# EAGLE design McPiFace-Camera-V1 (EAGLE 7.4.0)
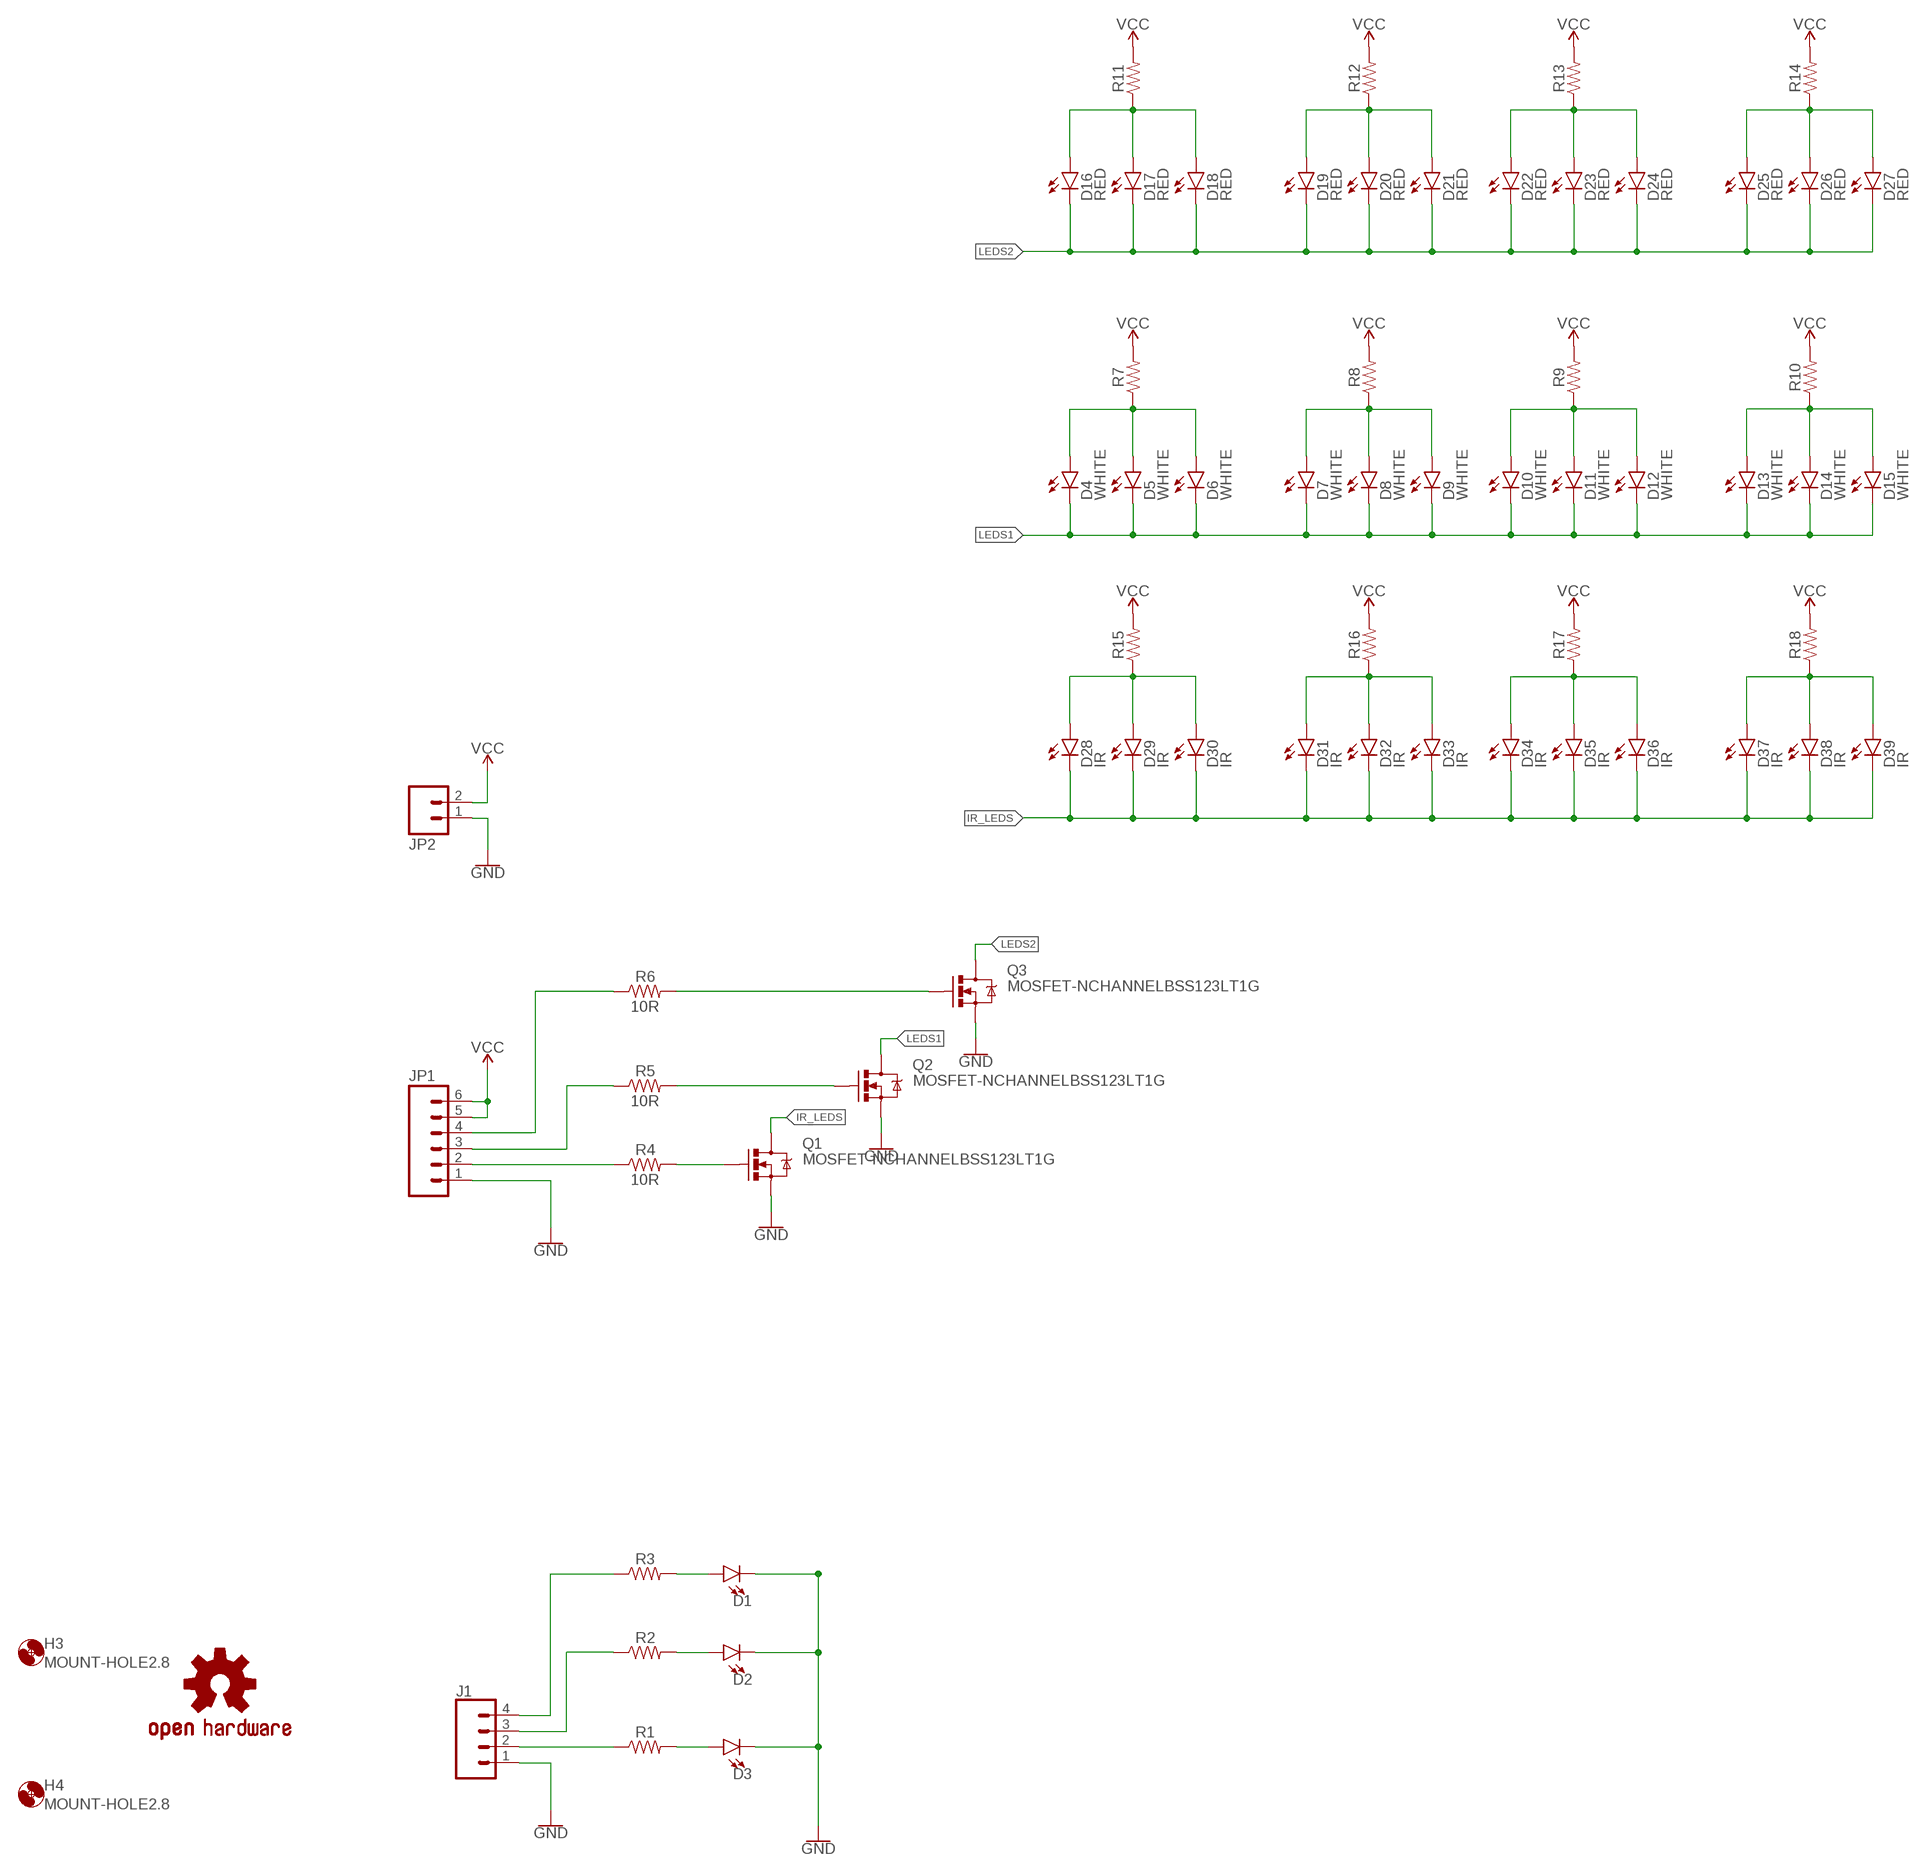
[diagram p0: schematic, sheet 1]

## Parts
D1  LED1206-BOTTOM-1.6MM  [LED-1206-BOTTOM-1.6MM]
D2  LED1206-BOTTOM-1.6MM  [LED-1206-BOTTOM-1.6MM]
D3  LED1206-BOTTOM-1.6MM  [LED-1206-BOTTOM-1.6MM]
D4  WHITE  LED-WHITE1206  [LED-1206]
D5  WHITE  LED-WHITE1206  [LED-1206]
D6  WHITE  LED-WHITE1206  [LED-1206]
D7  WHITE  LED-WHITE1206  [LED-1206]
D8  WHITE  LED-WHITE1206  [LED-1206]
D9  WHITE  LED-WHITE1206  [LED-1206]
D10  WHITE  LED-WHITE1206  [LED-1206]
D11  WHITE  LED-WHITE1206  [LED-1206]
D12  WHITE  LED-WHITE1206  [LED-1206]
D13  WHITE  LED-WHITE1206  [LED-1206]
D14  WHITE  LED-WHITE1206  [LED-1206]
D15  WHITE  LED-WHITE1206  [LED-1206]
D16  RED  LED-RED1206  [LED-1206]
D17  RED  LED-RED1206  [LED-1206]
D18  RED  LED-RED1206  [LED-1206]
D19  RED  LED-RED1206  [LED-1206]
D20  RED  LED-RED1206  [LED-1206]
D21  RED  LED-RED1206  [LED-1206]
D22  RED  LED-RED1206  [LED-1206]
D23  RED  LED-RED1206  [LED-1206]
D24  RED  LED-RED1206  [LED-1206]
D25  RED  LED-RED1206  [LED-1206]
D26  RED  LED-RED1206  [LED-1206]
D27  RED  LED-RED1206  [LED-1206]
D28  IR  LED1206  [LED-1206]
D29  IR  LED1206  [LED-1206]
D30  IR  LED1206  [LED-1206]
D31  IR  LED1206  [LED-1206]
D32  IR  LED1206  [LED-1206]
D33  IR  LED1206  [LED-1206]
D34  IR  LED1206  [LED-1206]
D35  IR  LED1206  [LED-1206]
D36  IR  LED1206  [LED-1206]
D37  IR  LED1206  [LED-1206]
D38  IR  LED1206  [LED-1206]
D39  IR  LED1206  [LED-1206]
H3  MOUNT-HOLE2.8  [2,8]
H4  MOUNT-HOLE2.8  [2,8]
J1  CONN_04SMD2  [1X04_1MM_RA]
JP1  M06SMD-1MM  [1X06-1MM]
JP2  M02-JST-2MM-SMT  [JST-2-SMD]
LOGO1  OSHW-LOGOL  [OSHW-LOGO-L]
Q1  MOSFET-NCHANNELBSS123LT1G  [SOT23-3]
Q2  MOSFET-NCHANNELBSS123LT1G  [SOT23-3]
Q3  MOSFET-NCHANNELBSS123LT1G  [SOT23-3]
R1  RESISTOR1206  [1206]
R2  RESISTOR1206  [1206]
R3  RESISTOR1206  [1206]
R4  10R  RESISTOR1206  [1206]
R5  10R  RESISTOR1206  [1206]
R6  10R  RESISTOR1206  [1206]
R7  RESISTOR1206  [1206]
R8  RESISTOR1206  [1206]
R9  RESISTOR1206  [1206]
R10  RESISTOR1206  [1206]
R11  RESISTOR1206  [1206]
R12  RESISTOR1206  [1206]
R13  RESISTOR1206  [1206]
R14  RESISTOR1206  [1206]
R15  RESISTOR1206  [1206]
R16  RESISTOR1206  [1206]
R17  RESISTOR1206  [1206]
R18  RESISTOR1206  [1206]

## Nets
GND: D1.C D2.C D3.C J1.1 JP1.1 JP2.1 Q1.2(S) Q2.2(S) Q3.2(S)
IR_LEDS: D28.C D29.C D30.C D31.C D32.C D33.C D34.C D35.C D36.C D37.C D38.C D39.C Q1.3(D)
LEDS1: D4.C D5.C D6.C D7.C D8.C D9.C D10.C D11.C D12.C D13.C D14.C D15.C Q2.3(D)
LEDS2: D16.C D17.C D18.C D19.C D20.C D21.C D22.C D23.C D24.C D25.C D26.C D27.C Q3.3(D)
N$2: D1.A R3.2
N$3: D2.A R2.2
N$4: D3.A R1.2
N$5: J1.2 R1.1
N$6: J1.3 R2.1
N$7: J1.4 R3.1
N$8: JP1.2 R4.1
N$9: JP1.3 R5.1
N$10: JP1.4 R6.1
N$11: Q3.1(G) R6.2
N$12: Q2.1(G) R5.2
N$13: Q1.1(G) R4.2
N$17: D13.A D14.A D15.A R10.1
N$18: D10.A D11.A D12.A R9.1
N$23: D7.A D8.A D9.A R8.1
N$25: D4.A D5.A D6.A R7.1
N$29: D16.A D17.A D18.A R11.1
N$32: D19.A D20.A D21.A R12.1
N$35: D22.A D23.A D24.A R13.1
N$38: D25.A D26.A D27.A R14.1
N$41: D28.A D29.A D30.A R15.1
N$44: D31.A D32.A D33.A R16.1
N$45: D34.A D35.A D36.A R17.1
N$46: D37.A D38.A D39.A R18.1
VCC: JP1.5 JP1.6 JP2.2 R7.2 R8.2 R9.2 R10.2 R11.2 R12.2 R13.2 R14.2 R15.2 R16.2 R17.2 R18.2

## Library data of the parts
D1-D3 = ThingySticks:LED: LED (Generic) Standard schematic elements and footprints for 5mm, 3mm, 1206, and 0603 sized LEDs. Generic LEDs with no color specified.
D4-D15 = SparkFun-LED:LED-WHITE: White SMD LEDs LilyPad 1206- DIO-09955; PROD_ID: DIO-09955
D16-D27 = SparkFun-LED:LED-RED: Assorted Red LEDs LilyPad 1206- DIO-09912 1206- DIO-00809 0603- DIO-00819 "SMART" means more efficient and expensive; PROD_ID: DIO-09912
D28-D39 = SparkFun-LED:LED: LEDs Standard schematic elements and footprints for 5mm, 3mm, 1206, and 0603 sized LEDs. 5mm - Spark Fun Electronics SKU : COM-00529 (and others)
H3 H4 = holes:MOUNT-HOLE: MOUNTING HOLE with drill center marker
J1 = SparkFun-Connectors:CONN_04: Multi connection point. Often used as Generic Header-pin footprint for 0.1 inch spaced/style header connections On any of the 0.1 inch spaced packages, you can populate with these: Break Away Headers - Straight <https://www.sparkfun.com/products/116> (PRT-00116) Break Away Male Headers - Right Angle <https://www.sparkfun.com/products/553> (PRT-00553) Female Headers <https://www.sparkfun.com/products/115> (PRT-00115) Break Away Headers - Machine Pin <https://www.sparkfun.com/products/117> (PRT-00117) Break Away Female Headers - Swiss Machine Pin <https://www.sparkfun.com/products/743> (PRT-00743) For SCREWTERMINALS and SPRING TERMINALS visit here: Screw Terimnals on SparkFun.com <https://www.sparkfun.com/search/results?term=Screw+Terminals> (5mm/3.5mm/2.54mm spacing) This device is also useful as a general connection point to wire up your design to another part of your project. Our various solder wires solder well into these plated through hole pads. Hook-Up Wire - Assortment (Stranded, 22 AWG) <https://www.sparkfun.com/products/11375> (PRT-11375) Hook-Up Wire - Assortment (Solid Core, 22 AWG) <https://www.sparkfun.com/products/11367> (PRT-11367) View the entire wire category on our website here <https://www.sparkfun.com/categories/141> Special notes: Molex polarized connector foot print use with SKU : PRT-08231 with associated crimp pins and housings. 1MM SMD Version SKU: PRT-10208; PROD_ID: CONN-10310; SF_ID: PRT-10208
JP1 = SparkFun-Connectors:M06: Header 6 Standard 6-pin 0.1" header. Use with straight break away headers (SKU : PRT-00116), right angle break away headers (PRT-00553), swiss pins (PRT-00743), machine pins (PRT-00117), and female headers (PRT-00115). Molex polarized connector foot print use with SKU : PRT-08094 with associated crimp pins and housings. NOTES ON THE VARIANTS LOCK and LOCK_LONGPADS... This footprint was designed to help hold the alignment of a through-hole component (i.e. 6-pin header) while soldering it into place. You may notice that each hole has been shifted either up or down by 0.005 of an inch from it's more standard position (which is a perfectly straight line). This slight alteration caused the pins (the squares in the middle) to touch the edges of the holes. Because they are alternating, it causes a "brace" to hold the component in place. 0.005 has proven to be the perfect amount of "off-center" position when using our standard breakaway headers. Although looks a little odd when you look at the bare footprint, once you have a header in there, the alteration is very hard to notice. Also,if you push a header all the way into place, it is covered up entirely on the bottom side. This idea of altering the position of holes to aid alignment will be further integrated into the Sparkfun Library for other footprints. It can help hold any component with 3 or more connection pins.
JP2 = SparkFun-Connectors:M02: Standard 2-pin 0.1" header. Use with - straight break away headers ( PRT-00116) - right angle break away headers (PRT-00553) - swiss pins (PRT-00743) - machine pins (PRT-00117) - female headers (PRT-00115) Molex polarized connector foot print use with: PRT-08233 with associated crimp pins and housings. 2.54_SCREWTERM for use with PRT-10571. 3.5mm Screw Terminal footprints for PRT-08084 5mm Screw Terminal footprints for use with PRT-08432; PROD_ID: CONN-11443
LOGO1 = SparkFun-Aesthetics:OSHW-LOGO: Open-Source Hardware (OSHW) Logo This logo indicates the piece of hardware it is found on incorporates a OSHW license and/or adheres to the definition of open source hardware found here: http://freedomdefined.org/OSHW
Q1-Q3 = SparkFun-DiscreteSemi:MOSFET-NCHANNEL: Common NMOSFET Parts MFG P/N Store ID Prod ID FDD8780 TRANS-09984 SI7820DN TRANS-11055 FDS6630A IC-08089 2N7002PW TRANS-11151 FQP30N06L COM-10213 TRANS-10060 BSS123LT1G TRANS-08345 BSS138 TRANS-00830 BS170 2N7000; PROD_ID: TRANS-08345
R1-R18 = SparkFun-Resistors:RESISTOR: Generic Resistor Package

## Board
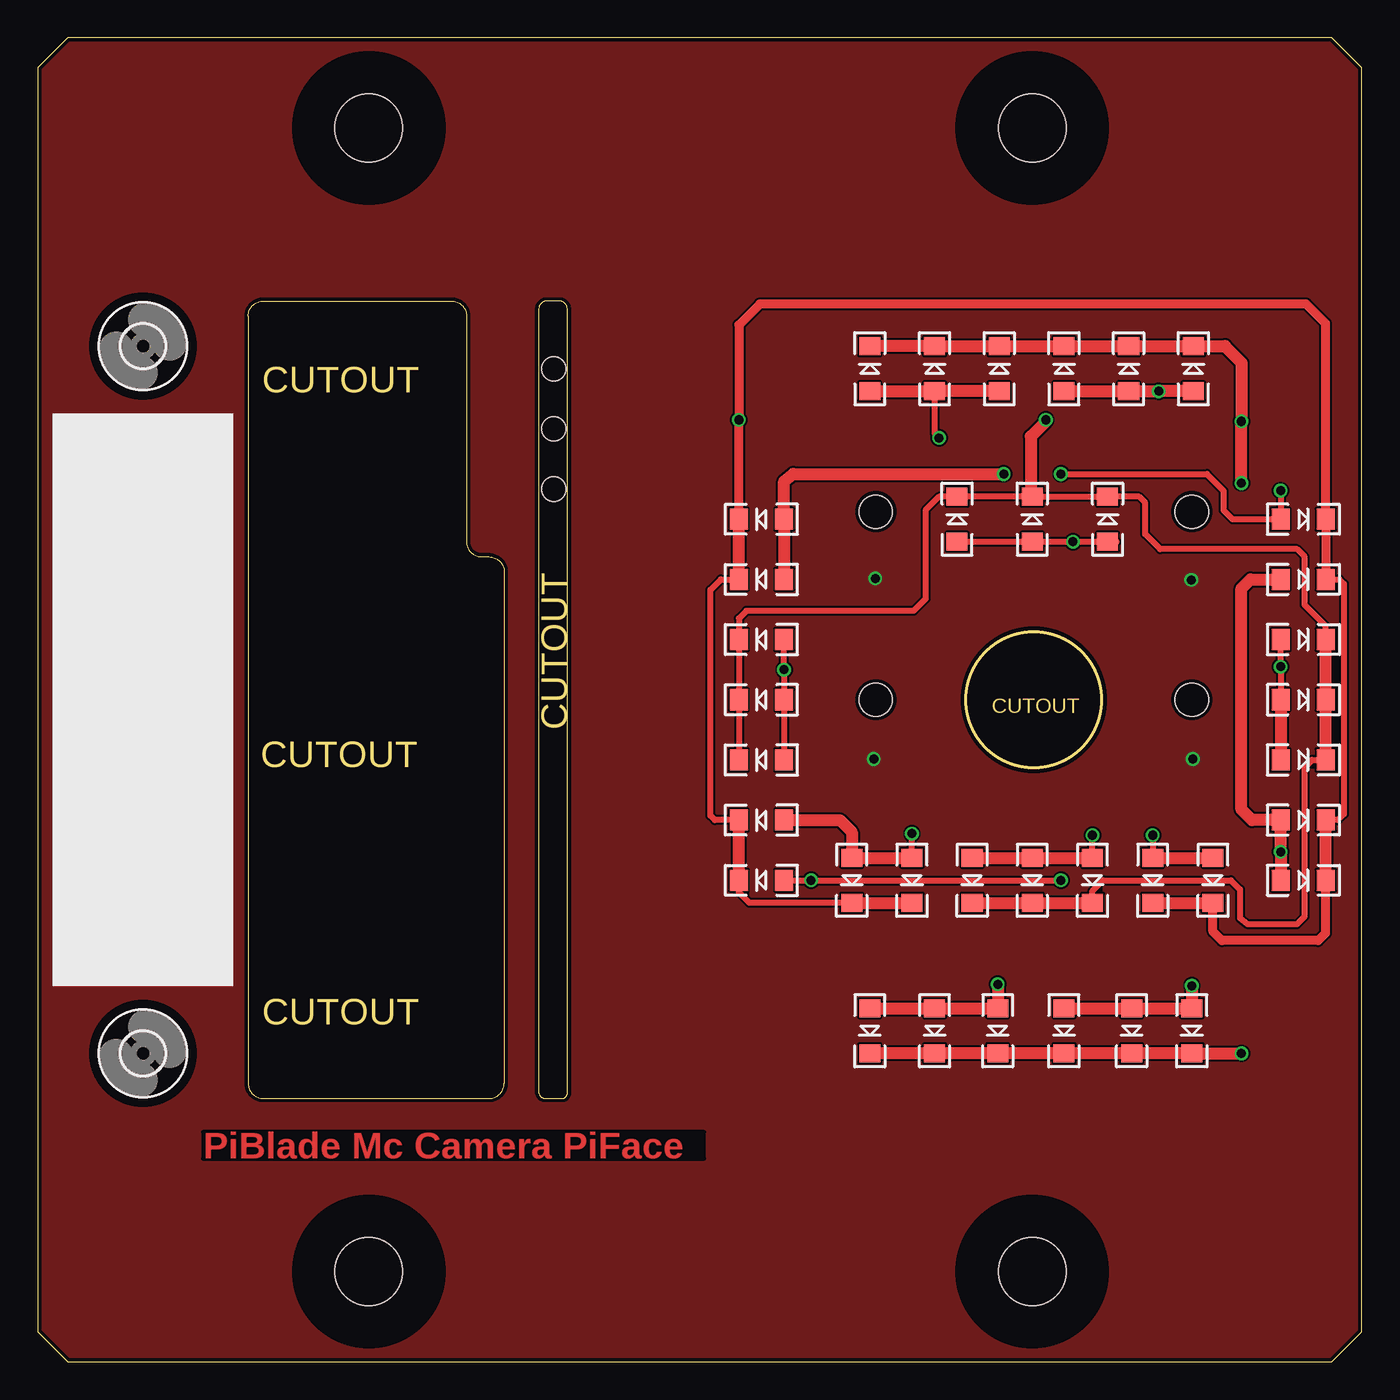
[diagram p1: board, top side]
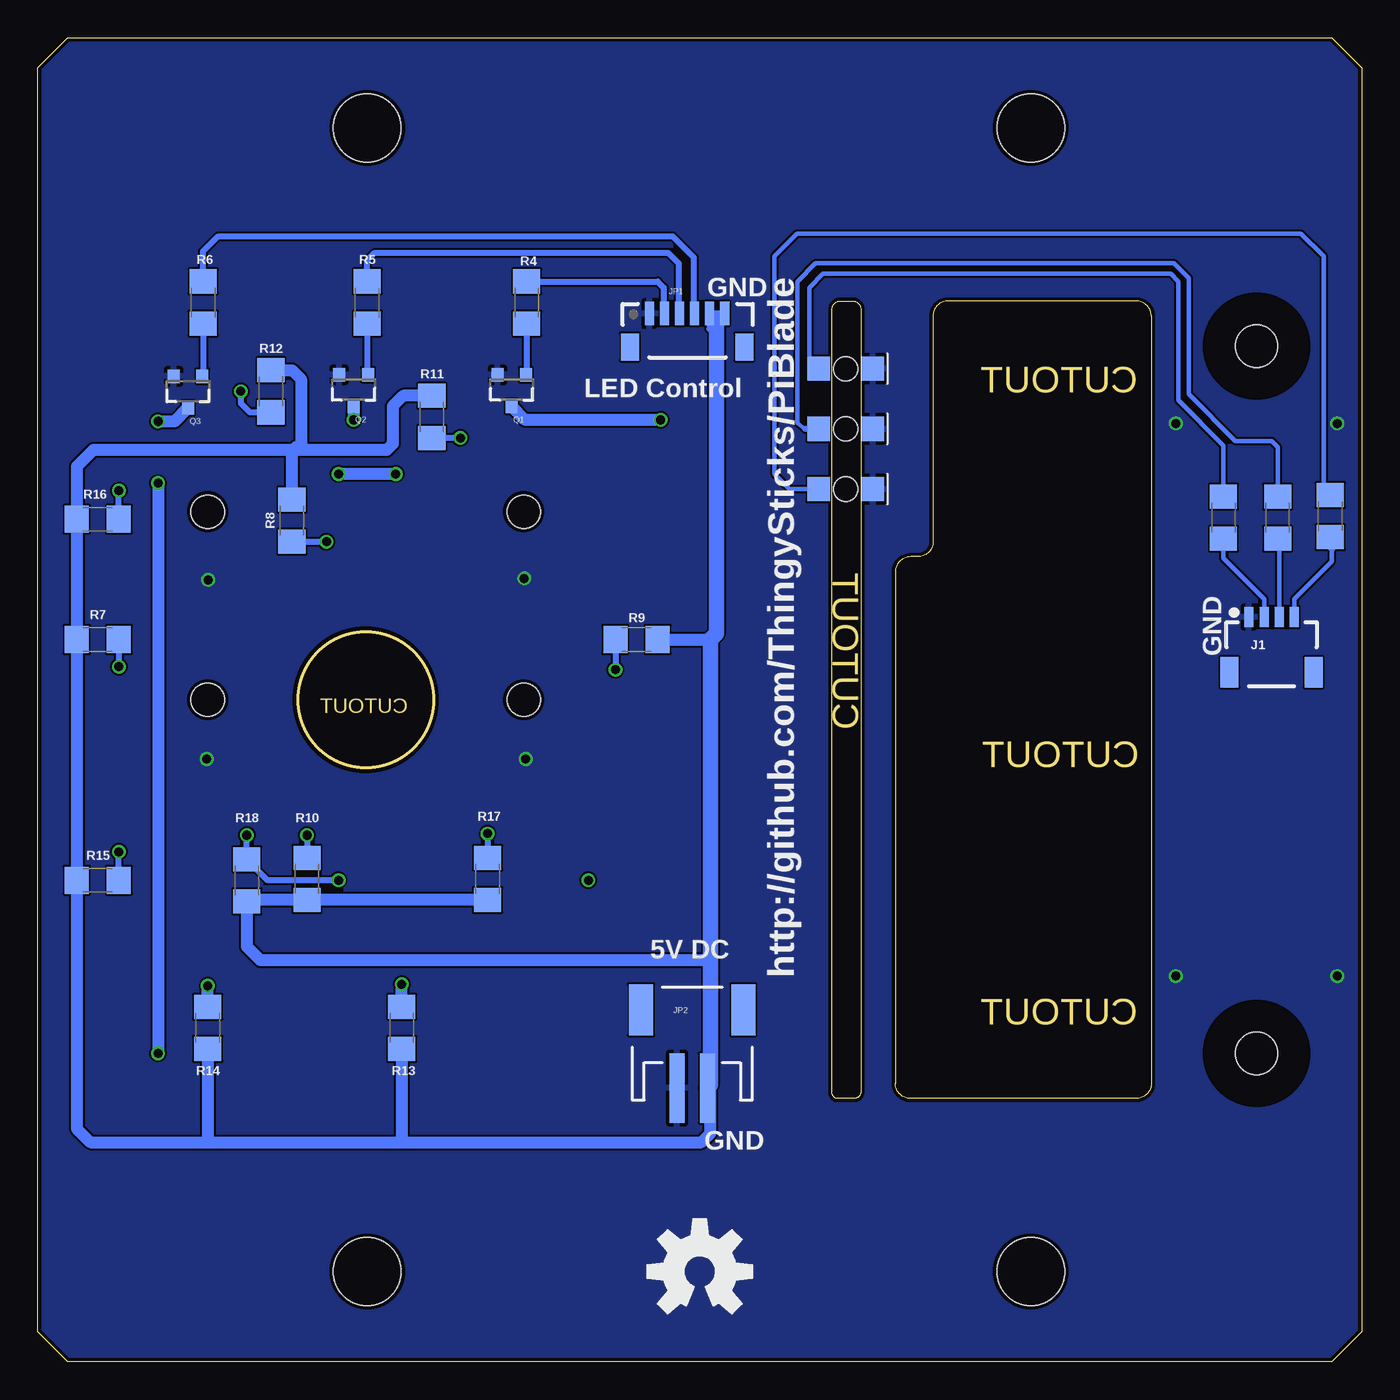
[diagram p2: board, bottom side, seen from below]

Size 88 x 88 mm. Coordinates in mm from the lower left corner, seen from the top.
Outline: 2,0 86,0 88,2 88,86 86,88 2,88 0,86 0,2 2,0
Outline: 14,69.5 14,18.5 arc90 15,17.5 30,17.5 arc90 31,18.5 31,52.5 arc90 30,53.5 29.5,53.5 arc-90 28.5,54.5 28.5,69.5 arc90 27.5,70.5 15,70.5 arc90 14,69.5
Outline: 33.3,18 arc90 33.7,17.5 34.9,17.5 arc90 35.2,18 35.2,70 arc90 34.6,70.5 33.8,70.5 arc90 33.3,69.9 33.3,18
Outline: circle at 66.2,44 radius 4.5
Copper layers (1*16): Top 0.035mm / dielectric 1.5mm / Bottom 0.035mm
Design rules "dirt_cheap_dirty_boards.v1": minimum track width 5mil, minimum drill 12mil, track to track 5mil, track to pad 5mil, pad to pad 5mil, via to via 5mil, smd to smd 0mil, copper to edge 10mil, drill to drill 10mil, minimum pad ring 10mil, minimum via ring 6mil, stop-mask expansion 2mil, vias tented up to drill 25mil, thermal gap 10mil
Holes 4.5 mm at 22,6 22,82 66.1,82 66.1,6
Holes 2.2 mm at 55.7,56.5 76.7,56.5 76.7,44 55.7,44
tRestrict: area 17,77 to 27,87; area 17,1 to 27,11; area 61.1,1 to 71.1,11; area 61.1,77 to 71.1,87

### Footprints (pad centres in the part's own frame; a part is rotated, then mirrored left to right if it is on the bottom)
LED-1206-BOTTOM-1.6MM = smd 1.5 x 1.6: A -1.8,0; C 1.8,0 | hole 1.6: 0,0
LED-1206 = smd 1.2 x 1.4: A -1.5,0; C 1.5,0
2,8 = hole 2.8: 0,0
1X04_1MM_RA = smd 0.6 x 1.35: 1 -1.5,0; 2 -0.5,0; 3 0.5,0; 4 1.5,0 | smd 1.2 x 2: NC1 2.8,-3.675; NC2 -2.8,-3.675
1X06-1MM = smd 0.6 x 1.55: 1 -2.54,1.27; 2 -1.54,1.27; 3 -0.54,1.27; 4 0.46,1.27; 5 1.46,1.27; 6 2.46,1.27 | smd 1.2 x 1.8: P$1 -3.84,-0.955; P$2 3.76,-0.955
JST-2-SMD = smd 1 x 4.6: 1 -1,-3.7; 2 1,-3.7 | smd 1.6 x 3.4: NC1 -3.4,1.5; NC2 3.4,1.5
SOT23-3 = smd 0.8 x 0.9: 1 -0.95,-1; 2 0.95,-1; 3 0,1.1
1206 = smd 1.6 x 1.8: 1 -1.4,0; 2 1.4,0

### Placement (x,y rotation side)
D1  34.3,58 0 bottom
D2  34.3,62 0 bottom
D3  34.3,66 0 bottom
D4  84.1,48 0 top
D5  84.1,44 0 top
D6  84.1,40 0 top
D7  61.1,56 90 top
D8  66.1,56 90 top
D9  71.1,56 90 top
D10  48.1,40 180 top
D11  48.1,44 180 top
D12  48.1,48 180 top
D13  70.1,32 270 top
D14  66.1,32 270 top
D15  62.1,32 270 top
D16  55.3,66 90 top
D17  59.6,66 90 top
D18  63.9,66 90 top
D19  68.2,66 90 top
D20  72.5,66 90 top
D21  76.8,66 90 top
D22  55.3,22 270 top
D23  59.6,22 270 top
D24  63.8,22 270 top
D25  68.2,22 270 top
D26  72.7,22 270 top
D27  76.7,22 270 top
D28  84.1,36 0 top
D29  84.1,32 0 top
D30  84.1,52 0 top
D31  84.1,56 0 top
D32  48.1,52 180 top
D33  48.1,56 180 top
D34  48.1,36 180 top
D35  58.1,32 270 top
D36  54.1,32 270 top
D37  74.1,32 270 top
D38  78.1,32 270 top
D39  48.1,32 180 top
H3  7,20.5 0 top
H4  7,67.5 0 top
J1  6,49.5 0 bottom
JP1  44.8,68.4 0 bottom
JP2  44.5,21.9 0 bottom
LOGO1  44,6 0 bottom
Q1  56.5,64.6 180 bottom
Q2  67,64.6 180 bottom
Q3  78,64.5 180 bottom
R1  9.2,56.1 90 bottom
R2  5.6,56.1 90 bottom
R3  2.1,56.2 90 bottom
R4  55.5,70.4 270 bottom
R5  66.1,70.4 270 bottom
R6  77,70.4 270 bottom
R7  84,48 180 bottom
R8  71.1,55.9 90 bottom
R9  48.2,48 0 bottom
R10  70.1,32.1 270 bottom
R11  61.8,62.8 90 bottom
R12  72.5,64.5 90 bottom
R13  63.8,22.2 270 bottom
R14  76.7,22.2 270 bottom
R15  84,32 180 bottom
R16  84,56 180 bottom
R17  58.1,32.1 270 bottom
R18  74.1,32 270 bottom

### Tracks (layer width: path | path; a pad name or v marks a point on that pad's centre or on a via)
GND  (via drill 0.6, 0.6 pad 0.25)
  other vias: 1.64,62.37 12.37,62.37 1.64,25.64 12.37,25.64 55.56,40.06 76.77,40.06 55.66,52.06 76.67,51.97
  pour Top: -1,88.5 88.7,88.5 88.7,-1 -1,-1
  pour Bottom: -1,88.5 88.7,88.5 88.7,-1 -1,-1
IR_LEDS  (via drill 0.6)
  Top 0.406: D36.C 47.3,30.5 46.6,31.2 D39.C | D34.C 45,36 44.7,36.3 44.7,51.3 45.4,52 D32.C | 46.6,56.5 D33.C | D30.C 86.5,52 86.8,51.7 86.8,36.4 86.4,36 D28.C | D38.C 78.5,30.5 78.6,30.6 78.2,30.6 D38.C
  Top 0.61: D30.C D31.C 85.6,69 84.3,70.3 48,70.3 46.6,68.9 v46.6,62.6 D33.C | D38.C 78.1,28.6 78.7,28 85.1,28 85.6,28.5 D29.C
  Top 0.813: D36.C D35.C | D39.C D34.C | D32.C D33.C | D37.C D38.C | D29.C D28.C
  Bottom 0.813: v46.6,62.6 55.6,62.6 Q1.3
LEDS1  (via drill 0.6)
  Top 0.406: v67,62.6 67,62.5 | 66,57.6 D8.C | D8.C D9.C 73.2,57.5 73.6,57.1 73.6,55 74.6,54 83.7,54 84.2,53.5 84.2,50.3 85.6,48.9 D4.C | D8.C D7.C 59.9,57.5 59,56.6 59,50.7 58.2,49.9 47.1,49.9 46.6,49.4 D12.C D11.C D10.C | D6.C 84.7,40 84.2,39.5 84.2,29.6 83.7,29.1 80.4,29.1 79.9,29.5 79.9,31.4 79.3,32 70.8,32 70.1,31.3 D13.C
  Top 0.813: 67,62.5 66,61.5 66,57.6 | D6.C D5.C D4.C | D15.C D14.C D13.C
  Bottom 0.813: Q2.3 v67,62.6
LEDS2  (via drill 0.6)
  Top 0.813: D16.C D17.C D18.C D19.C D20.C D21.C 78.9,67.5 80,66.4 v80,62.5 v80,58.4 | D22.C D23.C D24.C D25.C D26.C D27.C v80,20.5
  Bottom 0.813: v80,58.4 v80,20.5 | Q3.3 78.9,62.5 v80,62.5
N$2
  Bottom 0.305: D1.A 38.03,58 39.03,59 39.03,73.47 37.53,74.97 4.04,74.97 2.54,73.47 2.54,58.05 R3.2
N$3
  Bottom 0.305: 37,62 37.5,62.4 37.5,71.8 36.3,73 12.5,73 11.5,72 11.5,64.3 8.4,61.2 6,61.2 5.6,60.8 R2.2
  Bottom 0.406: D2.A 37,62
N$4
  Bottom 0.305: 36.5,66 36.7,66.5 36.7,71.4 35.8,72.3 12.7,72.3 12.2,71.8 12.2,63.9 9.2,60.9 R1.2
  Bottom 0.406: 35.9,66 D3.A 36.5,66
N$5
  Bottom 0.305: R1.1 9.2,53.4 6.5,50.7 J1.2
N$6
  Bottom 0.305: J1.3 5.5,55.1 5.6,55.2 R2.1
N$7
  Bottom 0.305: 2.5,54.5 2.4,54.5 R3.1 2,54.7 2,53.2 4.5,50.7 J1.4
  Bottom 0.406: 2,54 2.5,54.5
N$8
  Bottom 0.406: R4.1 46.8,71.8 46.4,71.4 46.4,70.01 JP1.2
N$9
  Bottom 0.406: R5.1 66.1,73.2 65.6,73.7 46.1,73.7 45.4,73 45.4,70.03 JP1.3
N$10
  Bottom 0.406: R6.1 77,73.8 76,74.8 45.8,74.8 44.4,73.4 44.4,70.03 JP1.4
N$11
  Bottom 0.406: R6.2 77,65.55 Q3.1
N$12
  Bottom 0.406: R5.2 66.1,65.65 Q2.1
N$13
  Bottom 0.406: R4.2 55.5,65.65 Q1.1
N$17  (via drill 0.6)
  Top 0.406: D13.A v70.1,35
  Top 0.813: D15.A D14.A D13.A
  Bottom 0.406: v70.1,35 D13.A
N$18  (via drill 0.6)
  Top 0.406: D10.A D11.A v49.6,46 R9.1
  Bottom 0.406: R9.1 v49.6,46
N$23  (via drill 0.6)
  Top 0.406: D7.A D8.A v68.8,54.5 D9.A | D9.A 71.7,54.5 | 71.2,54.4 D9.A
  Bottom 0.406: D9.A v68.8,54.5
N$25  (via drill 0.6)
  Top 0.406: D5.A v82.6,46.2 D4.A
  Top 0.813: D5.A D6.A
  Bottom 0.406: D4.A v82.6,46.2
N$29  (via drill 0.6)
  Top 0.406: D17.A 59.6,61.7 v59.9,61.4
  Top 0.813: D16.A D17.A D18.A
  Bottom 0.406: v59.9,61.4 R11.1
N$32  (via drill 0.6)
  Top 0.813: D21.A v74.5,64.5 D20.A D19.A
  Bottom 0.406: v74.5,64.5 74.5,63.7 73.9,63.1 R12.1
N$35  (via drill 0.6)
  Top 0.813: D22.A D23.A D24.A v63.8,25.1
  Bottom 0.813: R13.1 v63.8,25.1
N$38  (via drill 0.6)
  Top 0.813: D25.A D26.A D27.A v76.7,25
  Bottom 0.813: R14.1 v76.7,25
N$41  (via drill 0.6)
  Top 0.813: D30.A 80.6,52 80,51.4 80,36.7 80.7,36 D28.A v82.6,33.9 R15.1
  Bottom 0.406: R15.1 v82.6,33.9
N$44  (via drill 0.6)
  Top 0.406: v82.6,57.9 R16.1 79.4,56 78.8,56.6 78.8,57.9 77.7,59 v68,59
  Top 0.813: D32.A D33.A 49.6,58.5 50.2,59 v64.2,59
  Bottom 0.406: R16.1 v82.6,57.9
  Bottom 0.813: v64.2,59 v68,59
N$45  (via drill 0.6)
  Top 0.406: R17.1 v58.1,35.1
  Top 0.813: D34.A 53.3,36 54.1,35.2 D36.A R17.1
  Bottom 0.406: v58.1,35.1 R17.1
N$46  (via drill 0.6)
  Top 0.406: D39.A v51.4,32 v68,32 | R18.1 D37.A v74.1,35 | v74.1,35 74,35.1 74,35.2 v74.1,35
  Top 0.813: D37.A D38.A
  Bottom 0.406: v74.1,35 R18.1 72.7,32 v68,32
VCC
  Bottom 0.406: 42.9,69.2 43.36,68.64 JP1.5 JP1.6 | 74,30.7 R18.2
  Bottom 0.813: R17.2 R10.2 74,30.7 | R11.2 63.7,64.2 64.4,63.5 64.4,61 64.8,60.6 71,60.6 | 71.1,60.6 84.3,60.6 85.4,59.5 R16.2 R7.2 R15.2 85.4,15.5 84.5,14.6 76.6,14.6 | R12.2 71.1,65.9 70.5,65.3 70.5,60.8 70.8,60.8 71,60.6 | R8.2 71.1,60.6 | R9.2 43.3,48 | 76.6,14.6 63.6,14.6 | 63.6,14.6 43.9,14.6 43.3,15.2 43.3,18 JP2.2 | R14.2 76.7,14.7 76.6,14.6 | R13.2 63.8,14.8 63.6,14.6 | R18.2 74.1,27.6 73.2,26.7 43.4,26.7 43.3,26.6 | 71,60.6 71.1,60.6
  Bottom 1.016: 42.9,69.2 42.9,48.4 43.3,48 43.3,26.6 43.3,18.4 JP2.2

### Text on the board
Top: PiBlade Mc Camera PiFace
Dimension: CUTOUT | CUTOUT | CUTOUT | CUTOUT | CUTOUT
bNames: http://github.com/ThingySticks/PiBlade | GND | LED Control | GND | 5V DC | GND